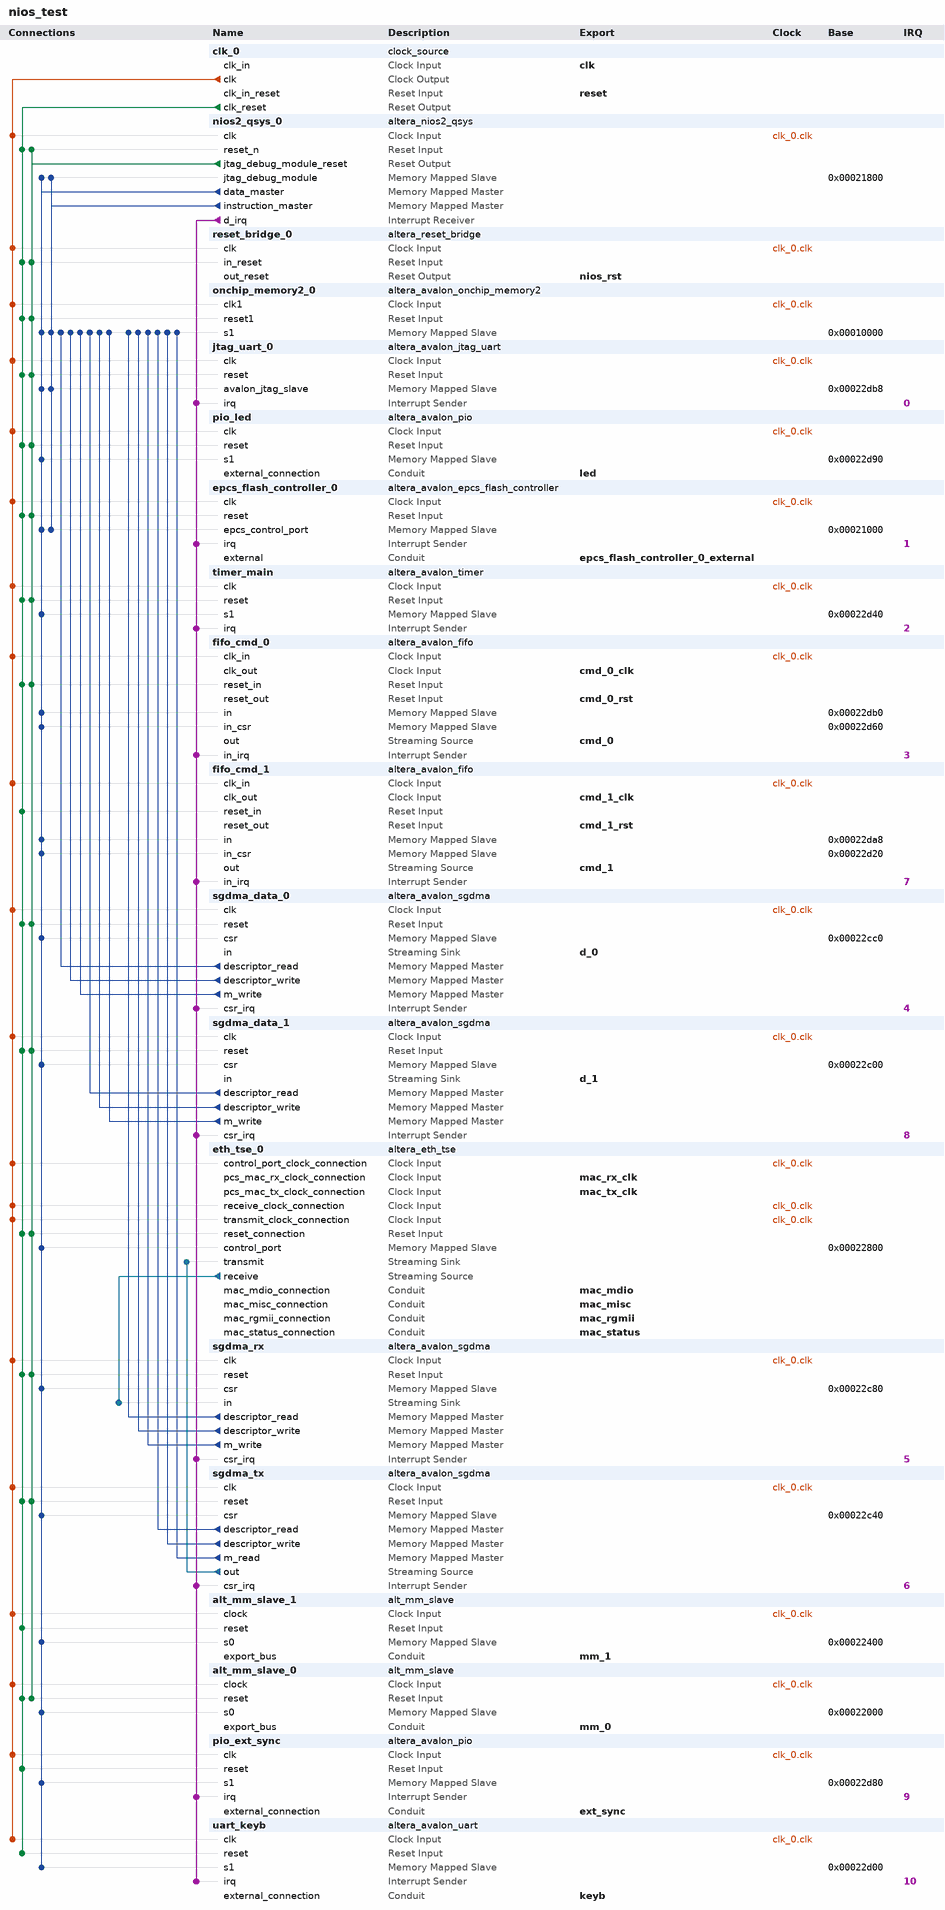
[diagram p0: system contents]
# Platform Designer (Qsys) system nios_test, Cyclone III EP3C40F484I7
# Parameters at their usual value, and those the tool derives, are not listed.
package require -exact qsys 13.1
create_system nios_test
set_project_property DEVICE_FAMILY {Cyclone III}
set_project_property DEVICE EP3C40F484I7

add_instance clk_0 clock_source 13.1
set_instance_parameter_value clk_0 clockFrequency 75000000

add_instance nios2_qsys_0 altera_nios2_qsys 13.1
set_instance_parameter_value nios2_qsys_0 resetSlave epcs_flash_controller_0.epcs_control_port
set_instance_parameter_value nios2_qsys_0 mmu_TLBMissExcSlave nios2_qsys_0.jtag_debug_module
set_instance_parameter_value nios2_qsys_0 exceptionSlave onchip_memory2_0.s1
set_instance_parameter_value nios2_qsys_0 breakSlave nios2_qsys_0.jtag_debug_module
set_instance_parameter_value nios2_qsys_0 muldiv_multiplierType LogicElementsFast
set_instance_parameter_value nios2_qsys_0 impl Fast
set_instance_parameter_value nios2_qsys_0 icache_size 4096

add_instance reset_bridge_0 altera_reset_bridge 13.1
set_instance_parameter_value reset_bridge_0 ACTIVE_LOW_RESET 0
set_instance_parameter_value reset_bridge_0 SYNCHRONOUS_EDGES deassert

add_instance onchip_memory2_0 altera_avalon_onchip_memory2 13.1
set_instance_parameter_value onchip_memory2_0 dataWidth 32
set_instance_parameter_value onchip_memory2_0 dualPort false
set_instance_parameter_value onchip_memory2_0 initMemContent true
set_instance_parameter_value onchip_memory2_0 initializationFileName /home/zaqc/work/altera/nc_nios_dma/nios_test/synthesis/submodules/nios_test_onchip_memory2_0.hex
set_instance_parameter_value onchip_memory2_0 memorySize 65535
set_instance_parameter_value onchip_memory2_0 useNonDefaultInitFile true

add_instance jtag_uart_0 altera_avalon_jtag_uart 13.1
set_instance_parameter_value jtag_uart_0 simInteractiveOptions NO_INTERACTIVE_WINDOWS

add_instance pio_led altera_avalon_pio 13.1
set_instance_parameter_value pio_led direction Output
set_instance_parameter_value pio_led width 8

add_instance epcs_flash_controller_0 altera_avalon_epcs_flash_controller 13.1

add_instance timer_main altera_avalon_timer 13.1
set_instance_parameter_value timer_main period 1
set_instance_parameter_value timer_main periodUnits MSEC

add_instance fifo_cmd_0 altera_avalon_fifo 13.1
set_instance_parameter_value fifo_cmd_0 bitsPerSymbol 32
set_instance_parameter_value fifo_cmd_0 channelWidth 0
set_instance_parameter_value fifo_cmd_0 errorWidth 0
set_instance_parameter_value fifo_cmd_0 fifoDepth 16
set_instance_parameter_value fifo_cmd_0 fifoInputInterfaceOptions AVALONMM_WRITE
set_instance_parameter_value fifo_cmd_0 fifoOutputInterfaceOptions AVALONST_SOURCE
set_instance_parameter_value fifo_cmd_0 singleClockMode false
set_instance_parameter_value fifo_cmd_0 symbolsPerBeat 1
set_instance_parameter_value fifo_cmd_0 useIRQ true
set_instance_parameter_value fifo_cmd_0 usePacket false
set_instance_parameter_value fifo_cmd_0 useReadControl false
set_instance_parameter_value fifo_cmd_0 useRegister true

add_instance fifo_cmd_1 altera_avalon_fifo 13.1
set_instance_parameter_value fifo_cmd_1 bitsPerSymbol 32
set_instance_parameter_value fifo_cmd_1 channelWidth 0
set_instance_parameter_value fifo_cmd_1 errorWidth 0
set_instance_parameter_value fifo_cmd_1 fifoDepth 16
set_instance_parameter_value fifo_cmd_1 fifoInputInterfaceOptions AVALONMM_WRITE
set_instance_parameter_value fifo_cmd_1 fifoOutputInterfaceOptions AVALONST_SOURCE
set_instance_parameter_value fifo_cmd_1 singleClockMode false
set_instance_parameter_value fifo_cmd_1 symbolsPerBeat 1
set_instance_parameter_value fifo_cmd_1 useIRQ true
set_instance_parameter_value fifo_cmd_1 usePacket true
set_instance_parameter_value fifo_cmd_1 useReadControl false
set_instance_parameter_value fifo_cmd_1 useRegister true

add_instance sgdma_data_0 altera_avalon_sgdma 13.1
set_instance_parameter_value sgdma_data_0 enableBurstTransfers false
set_instance_parameter_value sgdma_data_0 enableUnalignedTransfers false
set_instance_parameter_value sgdma_data_0 readBlockDataWidth 32
set_instance_parameter_value sgdma_data_0 sinkErrorWidth 0
set_instance_parameter_value sgdma_data_0 sourceErrorWidth 0
set_instance_parameter_value sgdma_data_0 transferMode STREAM_TO_MEMORY
set_instance_parameter_value sgdma_data_0 writeBurstcountWidth 4

add_instance sgdma_data_1 altera_avalon_sgdma 13.1
set_instance_parameter_value sgdma_data_1 enableBurstTransfers false
set_instance_parameter_value sgdma_data_1 enableUnalignedTransfers false
set_instance_parameter_value sgdma_data_1 readBlockDataWidth 32
set_instance_parameter_value sgdma_data_1 sinkErrorWidth 0
set_instance_parameter_value sgdma_data_1 sourceErrorWidth 0
set_instance_parameter_value sgdma_data_1 transferMode STREAM_TO_MEMORY
set_instance_parameter_value sgdma_data_1 writeBurstcountWidth 4

add_instance eth_tse_0 altera_eth_tse 13.1
set_instance_parameter_value eth_tse_0 core_variation MAC_ONLY
set_instance_parameter_value eth_tse_0 ifGMII RGMII
set_instance_parameter_value eth_tse_0 transceiver_type NONE
set_instance_parameter_value eth_tse_0 enable_hd_logic true
set_instance_parameter_value eth_tse_0 stat_cnt_ena true
set_instance_parameter_value eth_tse_0 enable_shift16 true
set_instance_parameter_value eth_tse_0 enable_mac_flow_ctrl false
set_instance_parameter_value eth_tse_0 enable_magic_detect true
set_instance_parameter_value eth_tse_0 mdio_clk_div 40
set_instance_parameter_value eth_tse_0 eg_addr 10
set_instance_parameter_value eth_tse_0 ing_addr 9

add_instance sgdma_rx altera_avalon_sgdma 13.1
set_instance_parameter_value sgdma_rx enableBurstTransfers false
set_instance_parameter_value sgdma_rx enableUnalignedTransfers false
set_instance_parameter_value sgdma_rx readBlockDataWidth 32
set_instance_parameter_value sgdma_rx sinkErrorWidth 6
set_instance_parameter_value sgdma_rx sourceErrorWidth 0
set_instance_parameter_value sgdma_rx transferMode STREAM_TO_MEMORY
set_instance_parameter_value sgdma_rx writeBurstcountWidth 4

add_instance sgdma_tx altera_avalon_sgdma 13.1
set_instance_parameter_value sgdma_tx enableBurstTransfers false
set_instance_parameter_value sgdma_tx enableUnalignedTransfers false
set_instance_parameter_value sgdma_tx readBlockDataWidth 32
set_instance_parameter_value sgdma_tx sinkErrorWidth 0
set_instance_parameter_value sgdma_tx sourceErrorWidth 1
set_instance_parameter_value sgdma_tx transferMode MEMORY_TO_STREAM
set_instance_parameter_value sgdma_tx writeBurstcountWidth 4

add_instance alt_mm_slave_1 alt_mm_slave 1.0

add_instance alt_mm_slave_0 alt_mm_slave 1.0

add_instance pio_ext_sync altera_avalon_pio 13.1
set_instance_parameter_value pio_ext_sync captureEdge true
set_instance_parameter_value pio_ext_sync direction Input
set_instance_parameter_value pio_ext_sync edgeType ANY
set_instance_parameter_value pio_ext_sync generateIRQ true
set_instance_parameter_value pio_ext_sync irqType EDGE
set_instance_parameter_value pio_ext_sync simDoTestBenchWiring true
set_instance_parameter_value pio_ext_sync width 32

add_instance uart_keyb altera_avalon_uart 13.1
set_instance_parameter_value uart_keyb baud 9600
set_instance_parameter_value uart_keyb dataBits 8
set_instance_parameter_value uart_keyb fixedBaud true
set_instance_parameter_value uart_keyb parity NONE
set_instance_parameter_value uart_keyb stopBits 1

# connections
add_connection clk_0.clk alt_mm_slave_0.clock clock
add_connection clk_0.clk alt_mm_slave_1.clock clock
add_connection clk_0.clk epcs_flash_controller_0.clk clock
add_connection clk_0.clk eth_tse_0.control_port_clock_connection clock
add_connection clk_0.clk eth_tse_0.receive_clock_connection clock
add_connection clk_0.clk eth_tse_0.transmit_clock_connection clock
add_connection clk_0.clk fifo_cmd_0.clk_in clock
add_connection clk_0.clk fifo_cmd_1.clk_in clock
add_connection clk_0.clk jtag_uart_0.clk clock
add_connection clk_0.clk nios2_qsys_0.clk clock
add_connection clk_0.clk onchip_memory2_0.clk1 clock
add_connection clk_0.clk pio_ext_sync.clk clock
add_connection clk_0.clk pio_led.clk clock
add_connection clk_0.clk reset_bridge_0.clk clock
add_connection clk_0.clk sgdma_data_0.clk clock
add_connection clk_0.clk sgdma_data_1.clk clock
add_connection clk_0.clk sgdma_rx.clk clock
add_connection clk_0.clk sgdma_tx.clk clock
add_connection clk_0.clk timer_main.clk clock
add_connection clk_0.clk uart_keyb.clk clock
add_connection clk_0.clk_reset alt_mm_slave_0.reset reset
add_connection clk_0.clk_reset alt_mm_slave_1.reset reset
add_connection clk_0.clk_reset epcs_flash_controller_0.reset reset
add_connection clk_0.clk_reset eth_tse_0.reset_connection reset
add_connection clk_0.clk_reset fifo_cmd_0.reset_in reset
add_connection clk_0.clk_reset fifo_cmd_1.reset_in reset
add_connection clk_0.clk_reset jtag_uart_0.reset reset
add_connection clk_0.clk_reset nios2_qsys_0.reset_n reset
add_connection clk_0.clk_reset onchip_memory2_0.reset1 reset
add_connection clk_0.clk_reset pio_ext_sync.reset reset
add_connection clk_0.clk_reset pio_led.reset reset
add_connection clk_0.clk_reset reset_bridge_0.in_reset reset
add_connection clk_0.clk_reset sgdma_data_0.reset reset
add_connection clk_0.clk_reset sgdma_data_1.reset reset
add_connection clk_0.clk_reset sgdma_rx.reset reset
add_connection clk_0.clk_reset sgdma_tx.reset reset
add_connection clk_0.clk_reset timer_main.reset reset
add_connection clk_0.clk_reset uart_keyb.reset reset
add_connection nios2_qsys_0.jtag_debug_module_reset alt_mm_slave_0.reset reset
add_connection nios2_qsys_0.jtag_debug_module_reset epcs_flash_controller_0.reset reset
add_connection nios2_qsys_0.jtag_debug_module_reset eth_tse_0.reset_connection reset
add_connection nios2_qsys_0.jtag_debug_module_reset fifo_cmd_0.reset_in reset
add_connection nios2_qsys_0.jtag_debug_module_reset jtag_uart_0.reset reset
add_connection nios2_qsys_0.jtag_debug_module_reset nios2_qsys_0.reset_n reset
add_connection nios2_qsys_0.jtag_debug_module_reset onchip_memory2_0.reset1 reset
add_connection nios2_qsys_0.jtag_debug_module_reset pio_led.reset reset
add_connection nios2_qsys_0.jtag_debug_module_reset reset_bridge_0.in_reset reset
add_connection nios2_qsys_0.jtag_debug_module_reset sgdma_data_0.reset reset
add_connection nios2_qsys_0.jtag_debug_module_reset sgdma_data_1.reset reset
add_connection nios2_qsys_0.jtag_debug_module_reset sgdma_rx.reset reset
add_connection nios2_qsys_0.jtag_debug_module_reset sgdma_tx.reset reset
add_connection nios2_qsys_0.jtag_debug_module_reset timer_main.reset reset
add_connection nios2_qsys_0.data_master alt_mm_slave_0.s0 avalon
set_connection_parameter_value nios2_qsys_0.data_master/alt_mm_slave_0.s0 baseAddress 0x00022000
add_connection nios2_qsys_0.data_master alt_mm_slave_1.s0 avalon
set_connection_parameter_value nios2_qsys_0.data_master/alt_mm_slave_1.s0 baseAddress 0x00022400
add_connection nios2_qsys_0.data_master epcs_flash_controller_0.epcs_control_port avalon
set_connection_parameter_value nios2_qsys_0.data_master/epcs_flash_controller_0.epcs_control_port baseAddress 0x00021000
add_connection nios2_qsys_0.data_master eth_tse_0.control_port avalon
set_connection_parameter_value nios2_qsys_0.data_master/eth_tse_0.control_port baseAddress 0x00022800
add_connection nios2_qsys_0.data_master fifo_cmd_0.in avalon
set_connection_parameter_value nios2_qsys_0.data_master/fifo_cmd_0.in baseAddress 0x00022db0
add_connection nios2_qsys_0.data_master fifo_cmd_0.in_csr avalon
set_connection_parameter_value nios2_qsys_0.data_master/fifo_cmd_0.in_csr baseAddress 0x00022d60
add_connection nios2_qsys_0.data_master fifo_cmd_1.in avalon
set_connection_parameter_value nios2_qsys_0.data_master/fifo_cmd_1.in baseAddress 0x00022da8
add_connection nios2_qsys_0.data_master fifo_cmd_1.in_csr avalon
set_connection_parameter_value nios2_qsys_0.data_master/fifo_cmd_1.in_csr baseAddress 0x00022d20
add_connection nios2_qsys_0.data_master jtag_uart_0.avalon_jtag_slave avalon
set_connection_parameter_value nios2_qsys_0.data_master/jtag_uart_0.avalon_jtag_slave baseAddress 0x00022db8
add_connection nios2_qsys_0.data_master nios2_qsys_0.jtag_debug_module avalon
set_connection_parameter_value nios2_qsys_0.data_master/nios2_qsys_0.jtag_debug_module baseAddress 0x00021800
add_connection nios2_qsys_0.data_master onchip_memory2_0.s1 avalon
set_connection_parameter_value nios2_qsys_0.data_master/onchip_memory2_0.s1 baseAddress 0x00010000
add_connection nios2_qsys_0.data_master pio_ext_sync.s1 avalon
set_connection_parameter_value nios2_qsys_0.data_master/pio_ext_sync.s1 baseAddress 0x00022d80
add_connection nios2_qsys_0.data_master pio_led.s1 avalon
set_connection_parameter_value nios2_qsys_0.data_master/pio_led.s1 baseAddress 0x00022d90
add_connection nios2_qsys_0.data_master sgdma_data_0.csr avalon
set_connection_parameter_value nios2_qsys_0.data_master/sgdma_data_0.csr baseAddress 0x00022cc0
add_connection nios2_qsys_0.data_master sgdma_data_1.csr avalon
set_connection_parameter_value nios2_qsys_0.data_master/sgdma_data_1.csr baseAddress 0x00022c00
add_connection nios2_qsys_0.data_master sgdma_rx.csr avalon
set_connection_parameter_value nios2_qsys_0.data_master/sgdma_rx.csr baseAddress 0x00022c80
add_connection nios2_qsys_0.data_master sgdma_tx.csr avalon
set_connection_parameter_value nios2_qsys_0.data_master/sgdma_tx.csr baseAddress 0x00022c40
add_connection nios2_qsys_0.data_master timer_main.s1 avalon
set_connection_parameter_value nios2_qsys_0.data_master/timer_main.s1 baseAddress 0x00022d40
add_connection nios2_qsys_0.data_master uart_keyb.s1 avalon
set_connection_parameter_value nios2_qsys_0.data_master/uart_keyb.s1 baseAddress 0x00022d00
add_connection nios2_qsys_0.instruction_master epcs_flash_controller_0.epcs_control_port avalon
set_connection_parameter_value nios2_qsys_0.instruction_master/epcs_flash_controller_0.epcs_control_port baseAddress 0x00021000
add_connection nios2_qsys_0.instruction_master jtag_uart_0.avalon_jtag_slave avalon
set_connection_parameter_value nios2_qsys_0.instruction_master/jtag_uart_0.avalon_jtag_slave baseAddress 0x00022db8
add_connection nios2_qsys_0.instruction_master nios2_qsys_0.jtag_debug_module avalon
set_connection_parameter_value nios2_qsys_0.instruction_master/nios2_qsys_0.jtag_debug_module baseAddress 0x00021800
add_connection nios2_qsys_0.instruction_master onchip_memory2_0.s1 avalon
set_connection_parameter_value nios2_qsys_0.instruction_master/onchip_memory2_0.s1 baseAddress 0x00010000
add_connection sgdma_data_0.descriptor_read onchip_memory2_0.s1 avalon
set_connection_parameter_value sgdma_data_0.descriptor_read/onchip_memory2_0.s1 baseAddress 0x00010000
add_connection sgdma_data_0.descriptor_write onchip_memory2_0.s1 avalon
set_connection_parameter_value sgdma_data_0.descriptor_write/onchip_memory2_0.s1 baseAddress 0x00010000
add_connection sgdma_data_0.m_write onchip_memory2_0.s1 avalon
set_connection_parameter_value sgdma_data_0.m_write/onchip_memory2_0.s1 baseAddress 0x00010000
add_connection sgdma_data_1.descriptor_read onchip_memory2_0.s1 avalon
set_connection_parameter_value sgdma_data_1.descriptor_read/onchip_memory2_0.s1 baseAddress 0x00010000
add_connection sgdma_data_1.descriptor_write onchip_memory2_0.s1 avalon
set_connection_parameter_value sgdma_data_1.descriptor_write/onchip_memory2_0.s1 baseAddress 0x00010000
add_connection sgdma_data_1.m_write onchip_memory2_0.s1 avalon
set_connection_parameter_value sgdma_data_1.m_write/onchip_memory2_0.s1 baseAddress 0x00010000
add_connection sgdma_rx.descriptor_read onchip_memory2_0.s1 avalon
set_connection_parameter_value sgdma_rx.descriptor_read/onchip_memory2_0.s1 baseAddress 0x00010000
add_connection sgdma_rx.descriptor_write onchip_memory2_0.s1 avalon
set_connection_parameter_value sgdma_rx.descriptor_write/onchip_memory2_0.s1 baseAddress 0x00010000
add_connection sgdma_rx.m_write onchip_memory2_0.s1 avalon
set_connection_parameter_value sgdma_rx.m_write/onchip_memory2_0.s1 baseAddress 0x00010000
add_connection sgdma_tx.descriptor_read onchip_memory2_0.s1 avalon
set_connection_parameter_value sgdma_tx.descriptor_read/onchip_memory2_0.s1 baseAddress 0x00010000
add_connection sgdma_tx.descriptor_write onchip_memory2_0.s1 avalon
set_connection_parameter_value sgdma_tx.descriptor_write/onchip_memory2_0.s1 baseAddress 0x00010000
add_connection sgdma_tx.m_read onchip_memory2_0.s1 avalon
set_connection_parameter_value sgdma_tx.m_read/onchip_memory2_0.s1 baseAddress 0x00010000
add_connection eth_tse_0.receive sgdma_rx.in avalon_streaming
add_connection sgdma_tx.out eth_tse_0.transmit avalon_streaming
add_connection nios2_qsys_0.d_irq epcs_flash_controller_0.irq interrupt
set_connection_parameter_value nios2_qsys_0.d_irq/epcs_flash_controller_0.irq irqNumber 1
add_connection nios2_qsys_0.d_irq fifo_cmd_0.in_irq interrupt
set_connection_parameter_value nios2_qsys_0.d_irq/fifo_cmd_0.in_irq irqNumber 3
add_connection nios2_qsys_0.d_irq fifo_cmd_1.in_irq interrupt
set_connection_parameter_value nios2_qsys_0.d_irq/fifo_cmd_1.in_irq irqNumber 7
add_connection nios2_qsys_0.d_irq jtag_uart_0.irq interrupt
set_connection_parameter_value nios2_qsys_0.d_irq/jtag_uart_0.irq irqNumber 0
add_connection nios2_qsys_0.d_irq pio_ext_sync.irq interrupt
set_connection_parameter_value nios2_qsys_0.d_irq/pio_ext_sync.irq irqNumber 9
add_connection nios2_qsys_0.d_irq sgdma_data_0.csr_irq interrupt
set_connection_parameter_value nios2_qsys_0.d_irq/sgdma_data_0.csr_irq irqNumber 4
add_connection nios2_qsys_0.d_irq sgdma_data_1.csr_irq interrupt
set_connection_parameter_value nios2_qsys_0.d_irq/sgdma_data_1.csr_irq irqNumber 8
add_connection nios2_qsys_0.d_irq sgdma_rx.csr_irq interrupt
set_connection_parameter_value nios2_qsys_0.d_irq/sgdma_rx.csr_irq irqNumber 5
add_connection nios2_qsys_0.d_irq sgdma_tx.csr_irq interrupt
set_connection_parameter_value nios2_qsys_0.d_irq/sgdma_tx.csr_irq irqNumber 6
add_connection nios2_qsys_0.d_irq timer_main.irq interrupt
set_connection_parameter_value nios2_qsys_0.d_irq/timer_main.irq irqNumber 2
add_connection nios2_qsys_0.d_irq uart_keyb.irq interrupt
set_connection_parameter_value nios2_qsys_0.d_irq/uart_keyb.irq irqNumber 10

# exported interfaces
add_interface clk clock sink
set_interface_property clk EXPORT_OF clk_0.clk_in
add_interface reset reset sink
set_interface_property reset EXPORT_OF clk_0.clk_in_reset
add_interface led conduit end
set_interface_property led EXPORT_OF pio_led.external_connection
add_interface epcs_flash_controller_0_external conduit end
set_interface_property epcs_flash_controller_0_external EXPORT_OF epcs_flash_controller_0.external
add_interface cmd_0 avalon_streaming source
set_interface_property cmd_0 EXPORT_OF fifo_cmd_0.out
add_interface cmd_0_clk clock sink
set_interface_property cmd_0_clk EXPORT_OF fifo_cmd_0.clk_out
add_interface cmd_0_rst reset sink
set_interface_property cmd_0_rst EXPORT_OF fifo_cmd_0.reset_out
add_interface d_0 avalon_streaming sink
set_interface_property d_0 EXPORT_OF sgdma_data_0.in
add_interface mac_tx_clk clock sink
set_interface_property mac_tx_clk EXPORT_OF eth_tse_0.pcs_mac_tx_clock_connection
add_interface mac_rx_clk clock sink
set_interface_property mac_rx_clk EXPORT_OF eth_tse_0.pcs_mac_rx_clock_connection
add_interface mac_misc conduit end
set_interface_property mac_misc EXPORT_OF eth_tse_0.mac_misc_connection
add_interface mac_mdio conduit end
set_interface_property mac_mdio EXPORT_OF eth_tse_0.mac_mdio_connection
add_interface mac_rgmii conduit end
set_interface_property mac_rgmii EXPORT_OF eth_tse_0.mac_rgmii_connection
add_interface mac_status conduit end
set_interface_property mac_status EXPORT_OF eth_tse_0.mac_status_connection
add_interface cmd_1_clk clock sink
set_interface_property cmd_1_clk EXPORT_OF fifo_cmd_1.clk_out
add_interface cmd_1_rst reset sink
set_interface_property cmd_1_rst EXPORT_OF fifo_cmd_1.reset_out
add_interface cmd_1 avalon_streaming source
set_interface_property cmd_1 EXPORT_OF fifo_cmd_1.out
add_interface d_1 avalon_streaming sink
set_interface_property d_1 EXPORT_OF sgdma_data_1.in
add_interface mm_0 conduit end
set_interface_property mm_0 EXPORT_OF alt_mm_slave_0.export_bus
add_interface mm_1 conduit end
set_interface_property mm_1 EXPORT_OF alt_mm_slave_1.export_bus
add_interface nios_rst reset source
set_interface_property nios_rst EXPORT_OF reset_bridge_0.out_reset
add_interface ext_sync conduit end
set_interface_property ext_sync EXPORT_OF pio_ext_sync.external_connection
add_interface keyb conduit end
set_interface_property keyb EXPORT_OF uart_keyb.external_connection

set_interconnect_requirement {$system} qsys_mm.clockCrossingAdapter HANDSHAKE
set_interconnect_requirement {$system} qsys_mm.maxAdditionalLatency 1
set_interconnect_requirement {$system} qsys_mm.insertDefaultSlave false

save_system nios_test.qsys
